# Altium schematic sheet [05] - HDMI INPUT.SchDoc
size A3; DocumentNumber: 5; SheetNumber: 5; SheetTotal: 18
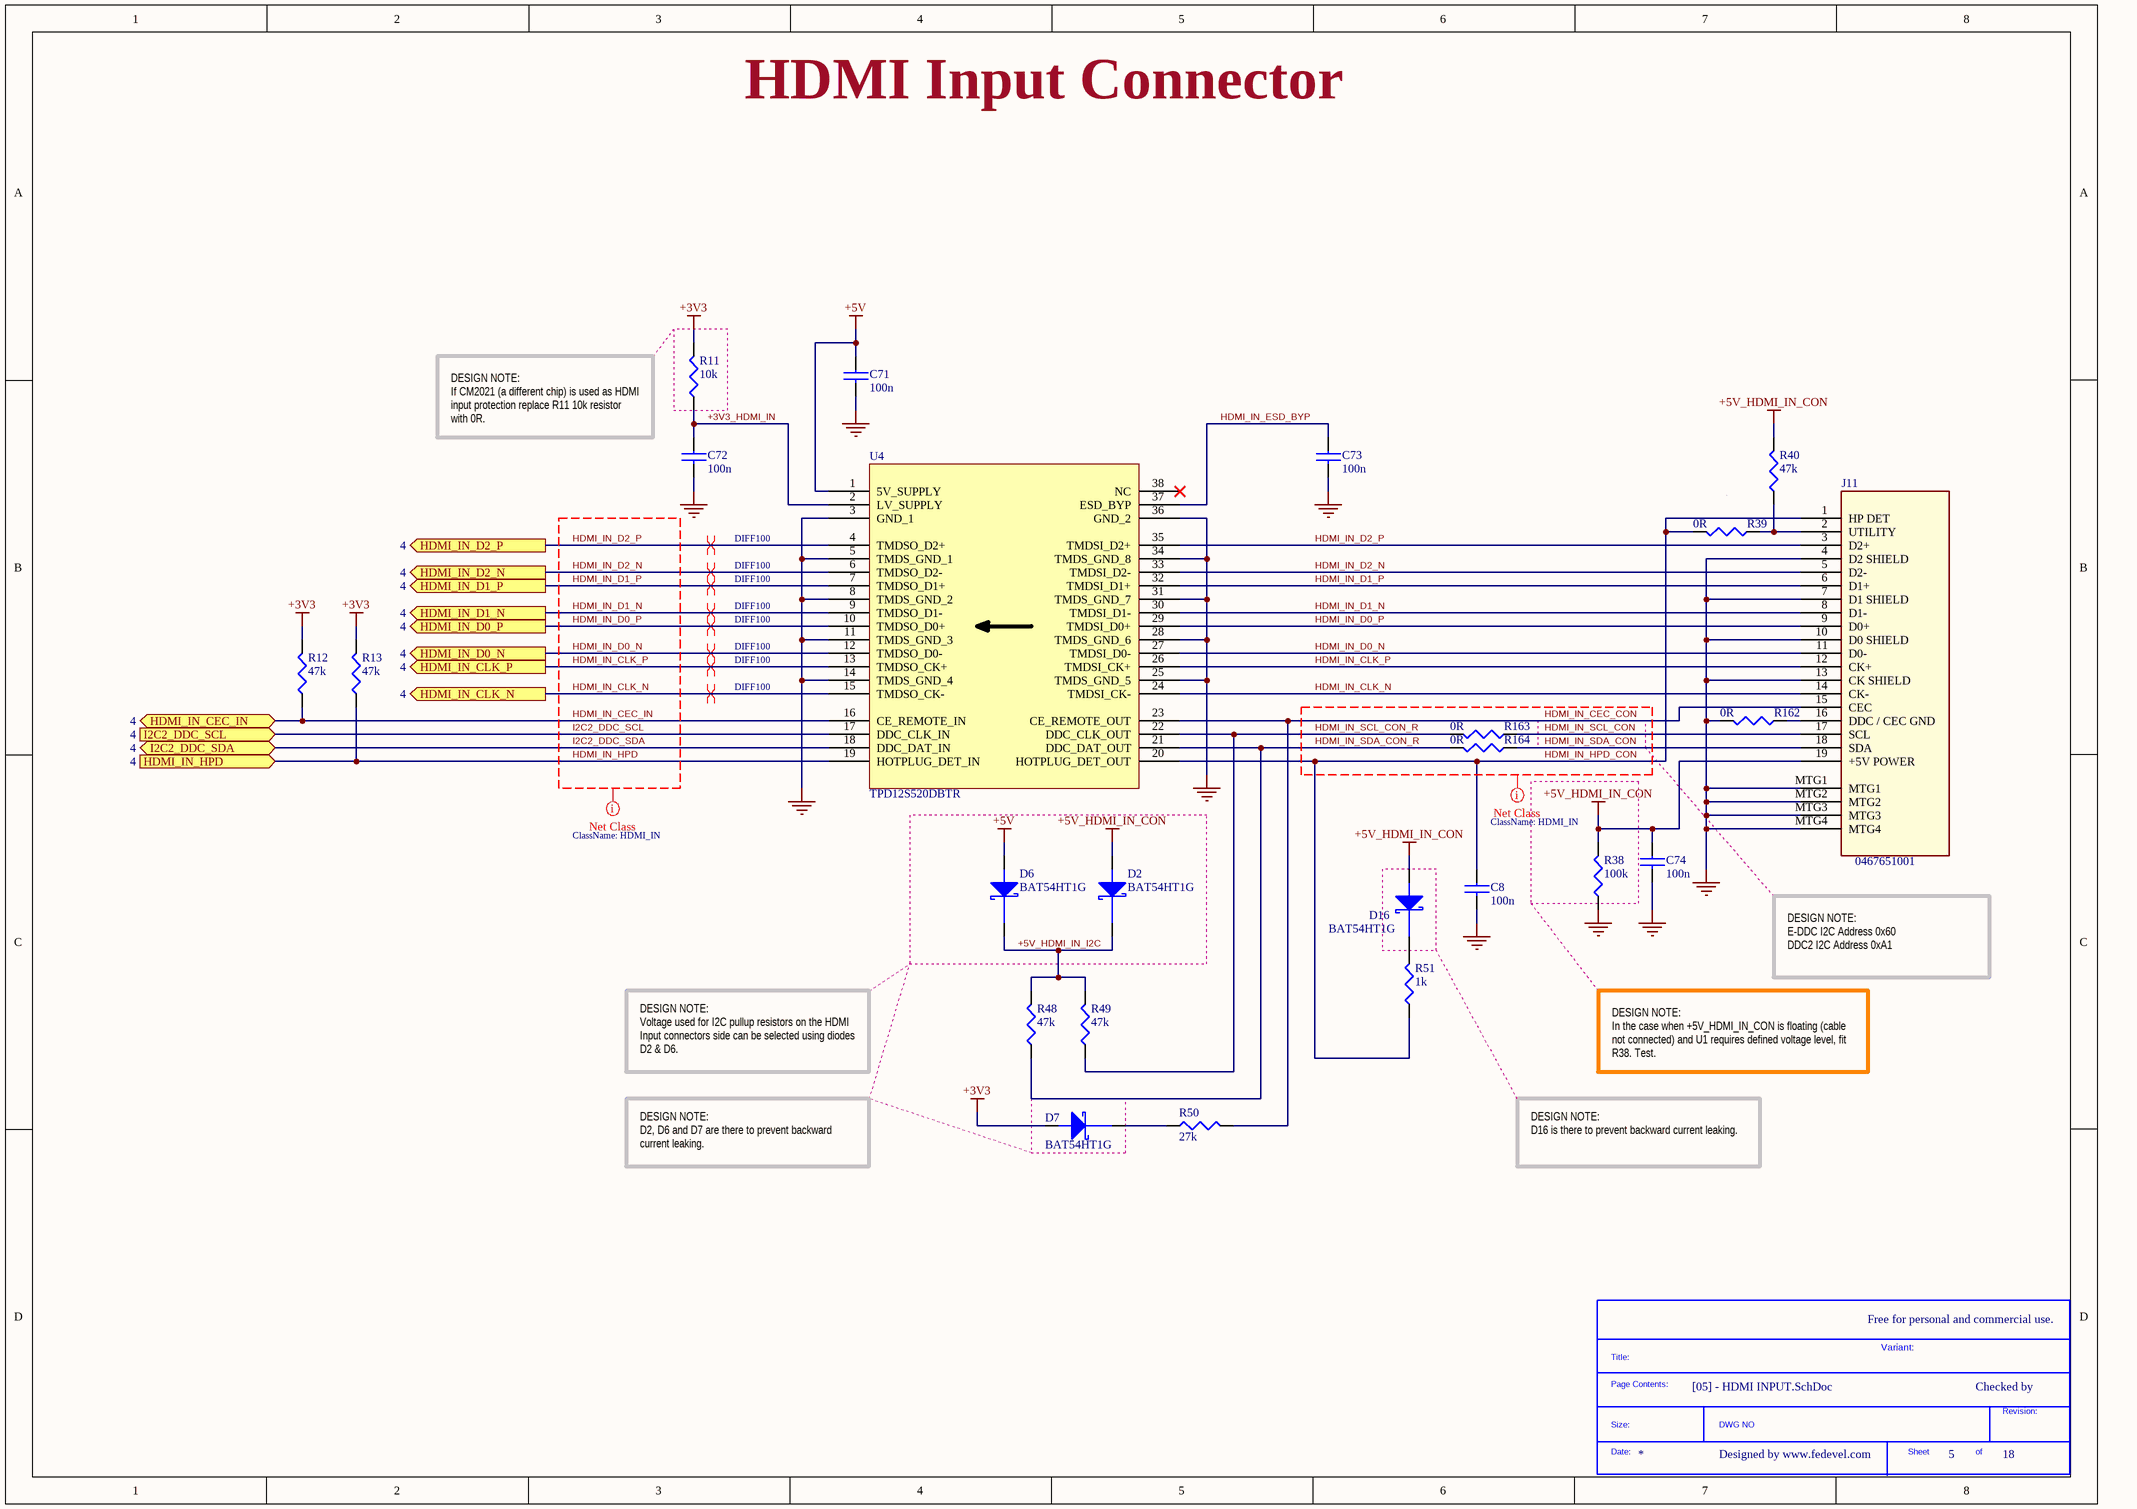
[diagram p0: [05] - HDMI INPUT.SchDoc]

## Parts
*  SDTitleBlock  (value not drawn)  (graphical)
C8  100n  [C0402]
C71  100n  [C0402]
C72  100n  [C0402]
C73  100n  [C0402]
C74  100n  [C0402]
D2  BAT54HT1G  [SOD323]
D6  BAT54HT1G  [SOD323]
D7  BAT54HT1G  [SOD323]
D16  BAT54HT1G  [SOD323]
J11  0467651001  [Micro_HDMI]
R11  10k  [R0402]
R12  47k  [R0402]
R13  47k  [R0402]
R38  100k  [R0402]
R39  0R  [R0402]
R40  47k  [R0402]
R48  47k  [R0402]
R49  47k  [R0402]
R50  27k  [R0402]
R51  1k  [R0402]
R162  0R  [R0402]
R163  0R  [R0402]
R164  0R  [R0402]
U4  TPD12S520DBTR  [TSSOP_38]

## Ports
HDMI_IN_CEC_IN (bidir, see 4), HDMI_IN_CLK_N (out, see 4), HDMI_IN_CLK_P (out, see 4), HDMI_IN_D0_N (out, see 4), HDMI_IN_D0_P (out, see 4), HDMI_IN_D1_N (out, see 4), HDMI_IN_D1_P (out, see 4), HDMI_IN_D2_N (out, see 4), HDMI_IN_D2_P (out, see 4), HDMI_IN_HPD (in, see 4), I2C2_DDC_SCL (in, see 4), I2C2_DDC_SDA (bidir, see 4)

## Nets
+3V3: D7.2(Anode) R11.2 R12.2 R13.2
+5V: C71.1 D6.2(Anode) U4.1(5V_SUPPLY)
+5V_HDMI_IN_CON: C74.1 D2.2(Anode) D16.2(Anode) J11.19(+5V_POWER) R38.2 R40.2
GND: C8.2 C71.2 C72.2 C73.2 C74.2 J11.4(D2_SHIELD) J11.7(D1_SHIELD) J11.10(D0_SHIELD) J11.13(CK_SHIELD) J11.MTG1 J11.MTG2 J11.MTG3 J11.MTG4 R38.1 R162.2 U4.3(GND_1) U4.5(TMDS_GND_1) U4.8(TMDS_GND_2) U4.11(TMDS_GND_3) U4.14(TMDS_GND_4) U4.25(TMDS_GND_5) U4.28(TMDS_GND_6) U4.31(TMDS_GND_7) U4.34(TMDS_GND_8) U4.36(GND_2)
+3V3_HDMI_IN: C72.1 R11.1 U4.2(LV_SUPPLY)
+5V_HDMI_IN_I2C: D2.1(Cathode) D6.1(Cathode) R48.2 R49.2
HDMI_IN_CEC_CON: J11.15(CEC) R50.2 U4.23(CE_REMOTE_OUT)
HDMI_IN_CEC_IN: R12.1 U4.16(CE_REMOTE_IN) ; port HDMI_IN_CEC_IN
HDMI_IN_CLK_N: J11.14(CK-) U4.15(TMDSO_CK-) U4.24(TMDSI_CK-) ; port HDMI_IN_CLK_N
HDMI_IN_CLK_P: J11.12(CK+) U4.13(TMDSO_CK+) U4.26(TMDSI_CK+) ; port HDMI_IN_CLK_P
HDMI_IN_D0_N: J11.11(D0-) U4.12(TMDSO_D0-) U4.27(TMDSI_D0-) ; port HDMI_IN_D0_N
HDMI_IN_D0_P: J11.9(D0+) U4.10(TMDSO_D0+) U4.29(TMDSI_D0+) ; port HDMI_IN_D0_P
HDMI_IN_D1_N: J11.8(D1-) U4.9(TMDSO_D1-) U4.30(TMDSI_D1-) ; port HDMI_IN_D1_N
HDMI_IN_D1_P: J11.6(D1+) U4.7(TMDSO_D1+) U4.32(TMDSI_D1+) ; port HDMI_IN_D1_P
HDMI_IN_D2_N: J11.5(D2-) U4.6(TMDSO_D2-) U4.33(TMDSI_D2-) ; port HDMI_IN_D2_N
HDMI_IN_D2_P: J11.3(D2+) U4.4(TMDSO_D2+) U4.35(TMDSI_D2+) ; port HDMI_IN_D2_P
HDMI_IN_ESD_BYP: C73.1 U4.37(ESD_BYP)
HDMI_IN_HPD: R13.1 U4.19(HOTPLUG_DET_IN) ; port HDMI_IN_HPD
HDMI_IN_HPD_CON: C8.1 J11.1(HP_DET) R39.2 R51.1 U4.20(HOTPLUG_DET_OUT)
HDMI_IN_SCL_CON: J11.17(SCL) R163.1
HDMI_IN_SCL_CON_R: R49.1 R163.2 U4.22(DDC_CLK_OUT)
HDMI_IN_SDA_CON: J11.18(SDA) R164.1
HDMI_IN_SDA_CON_R: R48.1 R164.2 U4.21(DDC_DAT_OUT)
I2C2_DDC_SCL: U4.17(DDC_CLK_IN) ; port I2C2_DDC_SCL
I2C2_DDC_SDA: U4.18(DDC_DAT_IN) ; port I2C2_DDC_SDA
NetD7_1: D7.1(Cathode) R50.1
NetD16_1: D16.1(Cathode) R51.2
NetJ11_2: J11.2(UTILITY) R39.1 R40.1
NetJ11_16: J11.16(DDC_/_CEC_GND) R162.1

Not connected (* = marked no-connect by the designer): U4 38(NC)*

## Layout directives
net class HDMI_IN: HDMI_IN_CEC_CON, HDMI_IN_CEC_IN, HDMI_IN_CLK_N, HDMI_IN_CLK_P, HDMI_IN_D0_N, HDMI_IN_D0_P, HDMI_IN_D1_N, HDMI_IN_D1_P, HDMI_IN_D2_N, HDMI_IN_D2_P, HDMI_IN_HPD, HDMI_IN_HPD_CON, HDMI_IN_SCL_CON, HDMI_IN_SCL_CON_R, HDMI_IN_SDA_CON, HDMI_IN_SDA_CON_R, I2C2_DDC_SCL, I2C2_DDC_SDA
differential pair; net class DIFF100: HDMI_IN_CLK_N, HDMI_IN_CLK_P, HDMI_IN_D0_N, HDMI_IN_D0_P, HDMI_IN_D1_N, HDMI_IN_D1_P, HDMI_IN_D2_N, HDMI_IN_D2_P

## Notes on the sheet
- HDMI Input Connector
- DESIGN NOTE:
  If CM2021 (a different chip) is used as HDMI input protection replace R11 10k resistor with 0R.
- DESIGN NOTE:
  E-DDC I2C Address 0x60
  DDC2 I2C Address 0xA1
- DESIGN NOTE:
  In the case when +5V_HDMI_IN_CON is floating (cable not connected) and U1 requires defined voltage level, fit R38. Test.
- DESIGN NOTE:
  Voltage used for I2C pullup resistors on the HDMI Input connectors side can be selected using diodes D2 & D6.
- DESIGN NOTE:
  D2, D6 and D7 are there to prevent backward current leaking.
- DESIGN NOTE:
  D16 is there to prevent backward current leaking.
- Free for personal and commercial use.
- Variant:
- Checked by
- Designed by www.fedevel.com
- (in symbol SDTitleBlock) Title:; Page Contents:; Revision:; Size:; DWG NO; Date:; Sheet; of

## Library data of the parts
C8 C71-C74 = C1005X5R1H104K: CAP CER .10UF 50V X5R 10% 0402; Manufacturer: TDK Corporation; Capacitance: 0.1µF; Value: 100nF; .Checked PCB: used; Category: Capacitors; Supplier Part Number: 445-5942-1-ND; Manufacturer Part Number: C1005X5R1H104K; Operating Temperature: -55°C ~ 85°C; Package / Case: 0402 (1005 Metric); Price 1k [$]: 0.02340; .Checked SCH: used; Voltage - Rated: 50V; Supplier: Digikey; Supplier 1: Digi-Key; Supplier Part Number 1: 445-5942-1-ND; RoHS: RoHS Compliant; Stock 1: 106926; Pricing 1: 1=0.27, 10=0.18, 100=0.072, 250=0.05176, 500=0.0369, 1000=0.027 (USD); Tolerance: ±10%; Temperature Coefficient: X5R; Mounting Type: Surface Mount, MLCC; Applications: General Purpose; Ratings: -; Size / Dimension: 0.039" L x 0.020" W (1.00mm x 0.50mm); Height - Seated (Max): -; Thickness (Max): 0.022" (0.55mm); Lead Spacing: -; Features: -; Packaging: Cut Tape (CT); Lead Style: -; ComponentLink1URL: http://www.tdk.co.jp/tefe02/e412_c.pdf; ComponentLink1Description: http://www.tdk.co.jp/tefe02/e412_c.pdf
D2 D6 D7 D16 = BAT54HT1G: DIODE SCHOTTKY 30V 0.2A SOD323; Manufacturer: Fairchild Semiconductor; Current - Average Rectified (Io): 200mA; Voltage - Forward (Vf) (Max) @ If: 800mV @ 100mA; Speed: Small Signal =< 200mA (Io), Any Speed; Reverse Recovery Time (trr): 5ns; Current - Reverse Leakage @ Vr: 2µA @ 25V; Capacitance @ Vr, F: 10pF @ 1V, 1MHz; Thermal Resistance: 600°C/W Ja; .Creator: MM; .Checked PCB: used; Supplier 1: Digi-Key; Manufacturer Part Number: BAT54HT1G; RoHS: RoHS Compliant; Category: Discrete Semiconductor Products; Stock 1: 11388; Pricing 1: 1=0.3, 10=0.276, 25=0.1984, 100=0.1543, 250=0.09696, 500=0.0826, 1000=0.05628 (USD); Packaging: Cut Tape (CT); Diode Type: Schottky; Voltage - DC Reverse (Vr) (Max): 30V; Mounting Type: Surface Mount; Package / Case: SC-76, SOD-323; Supplier Device Package: SOD-323; Operating Temperature - Junction: -55°C ~ 150°C; ComponentLink1URL: http://www.fairchildsemi.com/ds/BA/BAT54HT1G.pdf; ComponentLink1Description: http://www.fairchildsemi.com/ds/BA/BAT54HT1G.pdf; Supplier Part Number 1: BAT54HT1GCT-ND; .Checked SCH: used
J11 = 0467651001: CONN RCPT HDMI MICRO TYPE-D R/A; Manufacturer: Molex Inc; Connector Type: HDMI - Micro; Number of Contacts: 19; Gender: Receptacle; .Creator: MM; .Checked PCB: MM, paper model not checked; Supplier 1: Digi-Key; Manufacturer Part Number: 0467651001; RoHS: RoHS Compliant; Category: Connectors, Interconnects; Stock 1: 11830; Pricing 1: 1=2.66, 10=2.414, 25=2.2664, 50=2.1678, 100=2.0693, 250=1.87224, 500=1.72442 (USD); Packaging: Cut Tape (CT); Specifications: -; Mounting Type: Surface Mount, Right Angle, Horizontal; Features: Board Guide; Ingress Protection: -; ComponentLink1URL: http://www.molex.com/pdm_docs/sd/467651001_sd.pdf; ComponentLink1Description: http://www.molex.com/pdm_docs/sd/467651001_sd.pdf; Supplier Part Number 1: WM1282CT-ND; .Checked SCH: MM
R11 = RC0402FR-0710KL: RES 10.0K OHM 1/16W 1% 0402 SMD; Manufacturer: Yageo; Power (Watts): 0.063W, 1/16W; .Checked PCB: used; Temperature Coefficient: ±100ppm/°C; Category: Resistors; Supplier Part Number: 311-10.0KLRCT-ND; Manufacturer Part Number: RC0402FR-0710KL; Package / Case: 0402 (1005 Metric); Price 1k [$]: 0.01421; Resistance (Ohms): 10K; Tolerance: ±1%; Value: 10k; .Checked SCH: used; Supplier: Digikey; Supplier 1: Digi-Key; Supplier Part Number 1: 311-10.0KLRCT-ND; RoHS: RoHS Compliant; Stock 1: 2916495; Pricing 1: 10=0.014, 50=0.0104, 100=0.0079, 250=0.00584, 500=0.00432, 1000=0.00288 (USD); Composition: Thick Film; Features: -; Size / Dimension: 0.039" L x 0.020" W (1.00mm x 0.50mm); Height: 0.016" (0.40mm); Number of Terminations: 2; Packaging: Cut Tape (CT); ComponentLink1URL: http://www.yageo.com/documents/recent/PYu-RC0402_51_RoHS_L_6.pdf; ComponentLink1Description: http://www.yageo.com/documents/recent/PYu-RC0402_51_RoHS_L_6.pdf
R12 R13 R40 R48 R49 = RC0402FR-0747KL: RES 47.0K OHM 1/16W 1% 0402 SMD; Manufacturer: Yageo; Power (Watts): 0.063W, 1/16W; .Checked PCB: used; Temperature Coefficient: ±100ppm/°C; Category: Resistors; Supplier Part Number: 311-47.0KLRCT-ND; Manufacturer Part Number: RC0402FR-0747KL; Package / Case: 0402 (1005 Metric); Price 1k [$]: 0.01421; Resistance (Ohms): 47K; Tolerance: ±1%; Value: 47k; .Checked SCH: used; Supplier: Digikey; Supplier 1: Digi-Key; Supplier Part Number 1: 311-47.0KLRCT-ND; RoHS: RoHS Compliant; Stock 1: 1227580; Pricing 1: 10=0.014, 50=0.0104, 100=0.0079, 250=0.00584, 500=0.00432, 1000=0.00288 (USD); Composition: Thick Film; Features: -; Size / Dimension: 0.039" L x 0.020" W (1.00mm x 0.50mm); Height: 0.016" (0.40mm); Number of Terminations: 2; Packaging: Cut Tape (CT); ComponentLink1URL: http://www.yageo.com/documents/recent/PYu-RC0402_51_RoHS_L_6.pdf; ComponentLink1Description: http://www.yageo.com/documents/recent/PYu-RC0402_51_RoHS_L_6.pdf
R38 = RMCF0402FT100K: RES 100K OHM 1/16W 1% 0402 SMD; Manufacturer: Stackpole Electronics Inc; Power (Watts): 0.063W, 1/16W; .Checked PCB: used; Temperature Coefficient: ±100ppm/°C; Category: Resistors; Supplier Part Number: RMCF0402FT100KCT-ND; Manufacturer Part Number: RMCF0402FT100K; Package / Case: 0402 (1005 Metric); Price 1k [$]: 0.00384; Resistance (Ohms): 100K; Tolerance: ±1%; Value: 100k; .Checked SCH: used; Supplier: Digikey; Supplier 1: Digi-Key; Supplier Part Number 1: RMCF0402FT100KCT-ND; RoHS: RoHS Compliant; Stock 1: 95; Pricing 1: 1=0.04, 10=0.025, 50=0.0138, 100=0.0105, 250=0.0078, 500=0.00576, 1000=0.00384 (USD); Composition: Thick Film; Features: -; Size / Dimension: 0.039" L x 0.020" W (1.00mm x 0.50mm); Height: 0.016" (0.40mm); Number of Terminations: 2; Packaging: Cut Tape (CT); ComponentLink1URL: http://www.seielect.com/Catalog/SEI-RMCF.pdf; ComponentLink1Description: http://www.seielect.com/Catalog/SEI-RMCF.pdf
R39 R162-R164 = RC0402JR-070RL: RES 0.0 OHM 1/16W 0402 SMD; Manufacturer: Yageo; Resistance (Ohms): 0.0; Power (Watts): 0.063W, 1/16W; Tolerance: Jumper; .Checked PCB: used; Category: Resistors; Manufacturer Part Number: RC0402JR-070RL; Package / Case: 0402 (1005 Metric); Price 1k [$]: 0.01389; Value: 0R; .Checked SCH: used; Supplier Part Number: 311-0.0JRCT-ND; Supplier: Digikey; Supplier 1: Digi-Key; Supplier Part Number 1: 311-0.0JRCT-ND; RoHS: RoHS Compliant; Stock 1: 1106330; Pricing 1: 10=0.012, 50=0.009, 100=0.0069, 250=0.00512, 500=0.0038, 1000=0.00253 (USD); Composition: Thick Film; Features: -; Temperature Coefficient: -; Size / Dimension: 0.039" L x 0.020" W (1.00mm x 0.50mm); Height: 0.016" (0.40mm); Number of Terminations: 2; Packaging: Cut Tape (CT); ComponentLink1URL: http://www.yageo.com/documents/recent/PYu-RC0402_51_RoHS_L_6.pdf; ComponentLink1Description: http://www.yageo.com/documents/recent/PYu-RC0402_51_RoHS_L_6.pdf
R50 = RC0402FR-0727KL: RES 27.0K OHM 1/16W 1% 0402 SMD; Manufacturer: Yageo; Power (Watts): 0.063W, 1/16W; .Checked PCB: used; Temperature Coefficient: ±100ppm/°C; Category: Resistors; Supplier Part Number: 311-27.0KLRCT-ND; Manufacturer Part Number: RC0402FR-0727KL; Package / Case: 0402 (1005 Metric); Price 1k [$]: 0.00288; Resistance (Ohms): 27K; Tolerance: ±1%; Value: 27k; .Checked SCH: used; Supplier: Digikey; Supplier 1: Digi-Key; Supplier Part Number 1: 311-27.0KLRCT-ND; RoHS: RoHS Compliant; Stock 1: 21638; Pricing 1: 10=0.014, 50=0.0104, 100=0.0079, 250=0.00584, 500=0.00432, 1000=0.00288 (USD); Composition: Thick Film; Features: -; Size / Dimension: 0.039" L x 0.020" W (1.00mm x 0.50mm); Height: 0.016" (0.40mm); Number of Terminations: 2; Packaging: Cut Tape (CT); ComponentLink1URL: http://www.yageo.com/documents/recent/PYu-RC0402_51_RoHS_L_6.pdf; ComponentLink1Description: http://www.yageo.com/documents/recent/PYu-RC0402_51_RoHS_L_6.pdf
R51 = RC0402FR-071KL: RES 1.00K OHM 1/16W 1% 0402 SMD; Manufacturer: Yageo; Power (Watts): 0.063W, 1/16W; .Checked PCB: used; Temperature Coefficient: ±100ppm/°C; Category: Resistors; Supplier Part Number: 311-1.00KLRCT-ND; Manufacturer Part Number: RC0402FR-071KL; Package / Case: 0402 (1005 Metric); Price 1k [$]: 0.01421; Resistance (Ohms): 1K; Tolerance: ±1%; Value: 1k; .Checked SCH: used; Supplier: Digikey; Supplier 1: Digi-Key; Supplier Part Number 1: 311-1.00KLRCT-ND; RoHS: RoHS Compliant; Stock 1: 1753477; Pricing 1: 10=0.014, 50=0.0104, 100=0.0079, 250=0.00584, 500=0.00432, 1000=0.00288 (USD); Composition: Thick Film; Features: -; Size / Dimension: 0.039" L x 0.020" W (1.00mm x 0.50mm); Height: 0.016" (0.40mm); Number of Terminations: 2; Packaging: Cut Tape (CT); ComponentLink1URL: http://www.yageo.com/documents/recent/PYu-RC0402_51_RoHS_L_6.pdf; ComponentLink1Description: http://www.yageo.com/documents/recent/PYu-RC0402_51_RoHS_L_6.pdf
U4 = TPD12S520DBTR: IC HDMI RCVR PORT PROT 38-TSSOP; Manufacturer: Texas Instruments; Voltage - Supply: 5V; .Creator: MM; Supplier 1: Digi-Key; Manufacturer Part Number: TPD12S520DBTR; RoHS: RoHS Compliant; Category: Integrated Circuits (ICs); Stock 1: 5619; Pricing 1: 1=1.87, 10=1.685, 25=1.5092, 100=1.3572, 250=1.20512, 500=1.053, 750=0.95355, 1000=0.73125 (USD); Packaging: Cut Tape (CT); Applications: Video Equipment; Interface: HDMI; Package / Case: 38-TFSOP (0.173", 4.40mm Width); Supplier Device Package: 38-TSSOP; Mounting Type: Surface Mount; ComponentLink1URL: http://www.ti.com/lit/ds/symlink/tpd12s520.pdf; ComponentLink1Description: http://www.ti.com/lit/ds/symlink/tpd12s520.pdf; Supplier Part Number 1: 296-23617-1-ND; .Checked PCB: MM; .Checked SCH: MM